# EAGLE design HLD-stat-tracker-bottom (EAGLE 9.6.1)
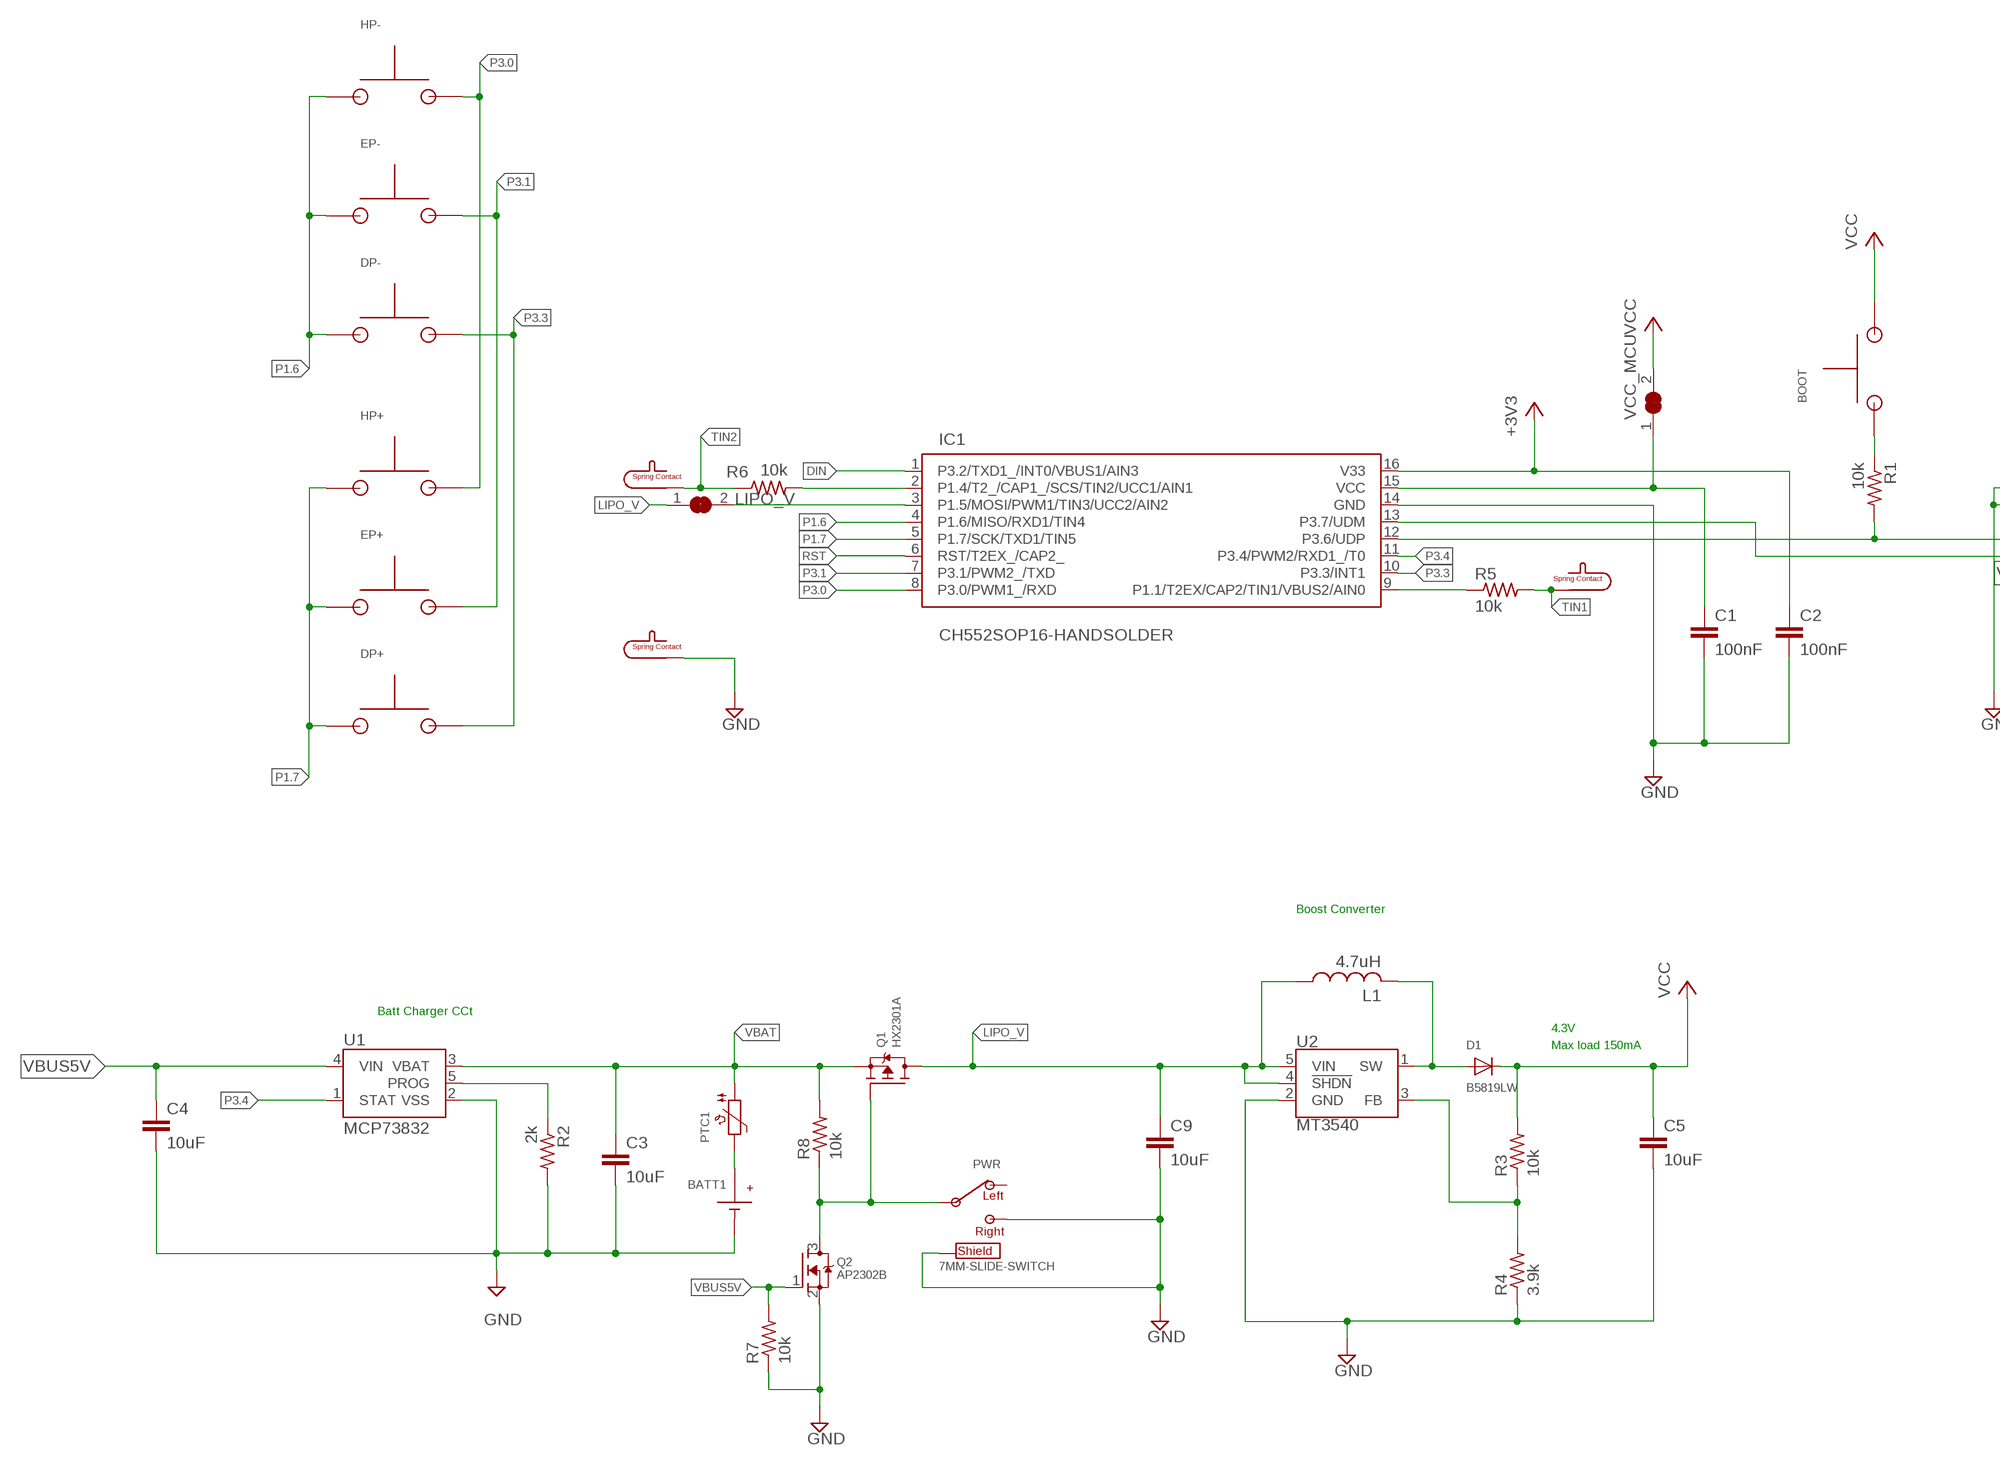
[diagram p0: schematic, sheet 1, part 1 of 2]
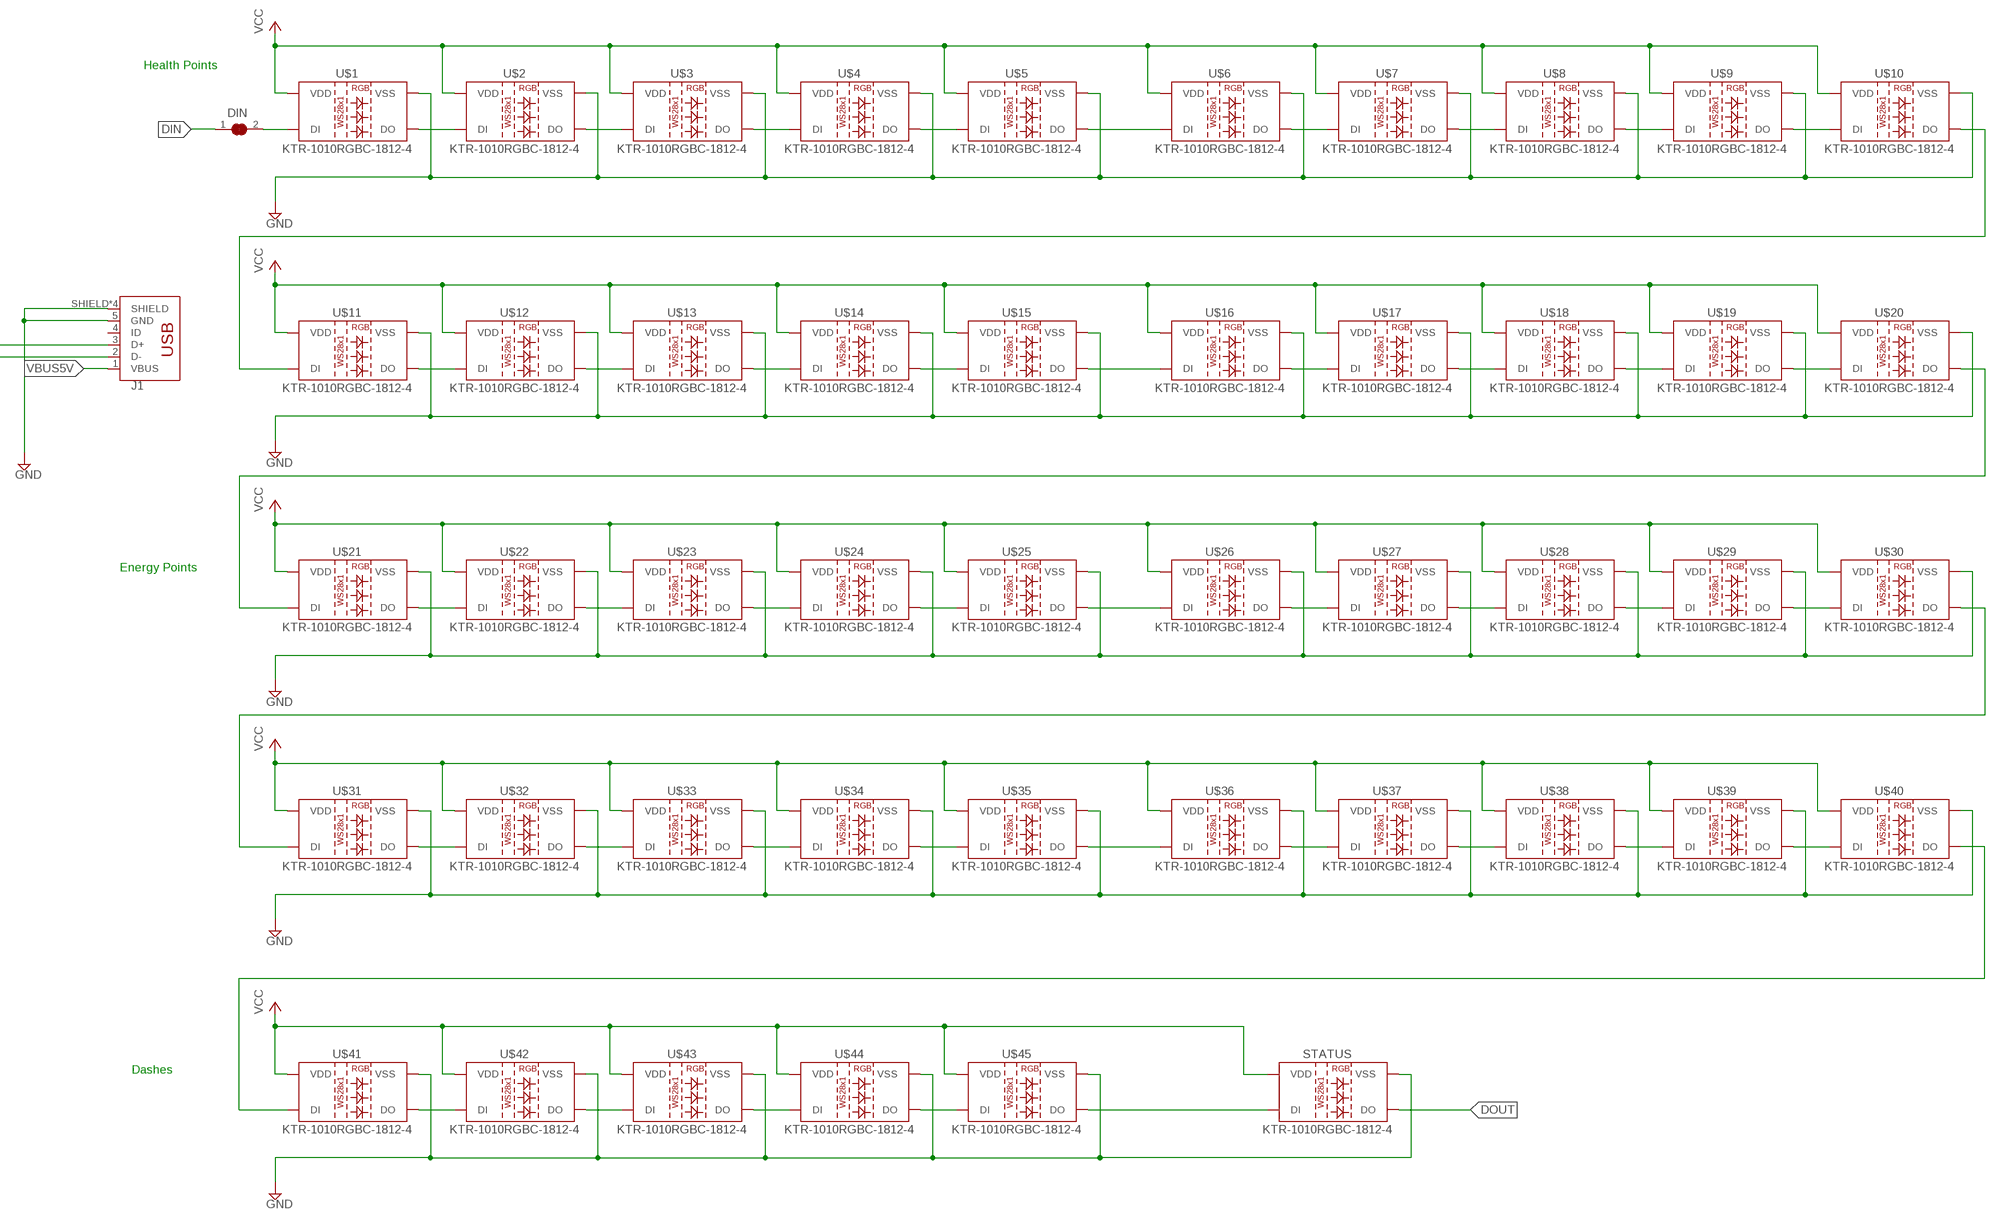
[diagram p1: schematic, sheet 1, part 2 of 2]

## Parts
BATT1  BATT+  [BATT+PAD]
BATT1-  BATT-  [BATT-PAD]
BOOT  TACTSW  [3MM-TACT]
C1  100nF  C-EUC0805K  [C0805K]
C2  100nF  C-EUC0805K  [C0805K]
C3  10uF  C-EUC0805K  [C0805K]
C4  10uF  C-EUC0805K  [C0805K]
C5  10uF  C-EUC0805K  [C0805K]
C9  10uF  C-EUC0805K  [C0805K]
D1  B5819LW  DIODESOD-123  [SOD-123]
DIN  SOLDERJUMPER-NC  [SOLDERJUMPER_CLOSEDWIRE_SMALL]
DP+  TACTSW  [3MM-TACT]
DP-  TACTSW  [3MM-TACT]
EP+  TACTSW  [3MM-TACT]
EP-  TACTSW  [3MM-TACT]
GND  SPRING-CONTACT  [818000905-SPRING-CONTACT]
HP+  TACTSW  [3MM-TACT]
HP-  TACTSW  [3MM-TACT]
IC1  CH552SOP16-HANDSOLDER  [SOP16-HANDSOLDER]
J1  USB_MICRO-BSINK-PLATE  [USB-B-MICRO-SMD-SINK-PLATE]
L1  4.7uH  INDUCTOR2012  [BEADC2012X105N]
LIPO_V  SOLDERJUMPER-NC  [SOLDERJUMPER_CLOSEDWIRE_SMALL]
PTC1  PTC0805  [WCAP-CSGP_0805_H1.25_R]
PWR  7MM-SLIDE-SWITCH  [7MM-SMD-SLIDE-SWITCH]
Q1  HX2301A  MOSFET-P  [SOT23-R]
Q2  AP2302B  MOSFET-NREFLOW  [SOT23-R]
R1  10k  R-US_R0805S  [R0805S]
R2  2k  R-US_R0805S  [R0805S]
R3  10k  R-US_R0805S  [R0805S]
R4  3.9k  R-US_R0805S  [R0805S]
R5  10k  R-US_R0805S  [R0805S]
R6  10k  R-US_R0805S  [R0805S]
R7  10k  R-US_R0805S  [R0805S]
R8  10k  R-US_R0805S  [R0805S]
STATUS  KTR-1010RGBC-1812-4  [SK6812-2020]
TIN1  SPRING-CONTACT  [818000905-SPRING-CONTACT]
TIN2  SPRING-CONTACT  [818000905-SPRING-CONTACT]
U1  MCP73832  MCP73831  [SOT23-5]
U2  MT3540  AP3012  [SOT23-5]
U$1  KTR-1010RGBC-1812-4  [SK6812-2020]
U$2  KTR-1010RGBC-1812-4  [SK6812-2020]
U$3  KTR-1010RGBC-1812-4  [SK6812-2020]
U$4  KTR-1010RGBC-1812-4  [SK6812-2020]
U$5  KTR-1010RGBC-1812-4  [SK6812-2020]
U$6  KTR-1010RGBC-1812-4  [SK6812-2020]
U$7  KTR-1010RGBC-1812-4  [SK6812-2020]
U$8  KTR-1010RGBC-1812-4  [SK6812-2020]
U$9  KTR-1010RGBC-1812-4  [SK6812-2020]
U$10  KTR-1010RGBC-1812-4  [SK6812-2020]
U$11  KTR-1010RGBC-1812-4  [SK6812-2020]
U$12  KTR-1010RGBC-1812-4  [SK6812-2020]
U$13  KTR-1010RGBC-1812-4  [SK6812-2020]
U$14  KTR-1010RGBC-1812-4  [SK6812-2020]
U$15  KTR-1010RGBC-1812-4  [SK6812-2020]
U$16  KTR-1010RGBC-1812-4  [SK6812-2020]
U$17  KTR-1010RGBC-1812-4  [SK6812-2020]
U$18  KTR-1010RGBC-1812-4  [SK6812-2020]
U$19  KTR-1010RGBC-1812-4  [SK6812-2020]
U$20  KTR-1010RGBC-1812-4  [SK6812-2020]
U$21  KTR-1010RGBC-1812-4  [SK6812-2020]
U$22  KTR-1010RGBC-1812-4  [SK6812-2020]
U$23  KTR-1010RGBC-1812-4  [SK6812-2020]
U$24  KTR-1010RGBC-1812-4  [SK6812-2020]
U$25  KTR-1010RGBC-1812-4  [SK6812-2020]
U$26  KTR-1010RGBC-1812-4  [SK6812-2020]
U$27  KTR-1010RGBC-1812-4  [SK6812-2020]
U$28  KTR-1010RGBC-1812-4  [SK6812-2020]
U$29  KTR-1010RGBC-1812-4  [SK6812-2020]
U$30  KTR-1010RGBC-1812-4  [SK6812-2020]
U$31  KTR-1010RGBC-1812-4  [SK6812-2020]
U$32  KTR-1010RGBC-1812-4  [SK6812-2020]
U$33  KTR-1010RGBC-1812-4  [SK6812-2020]
U$34  KTR-1010RGBC-1812-4  [SK6812-2020]
U$35  KTR-1010RGBC-1812-4  [SK6812-2020]
U$36  KTR-1010RGBC-1812-4  [SK6812-2020]
U$37  KTR-1010RGBC-1812-4  [SK6812-2020]
U$38  KTR-1010RGBC-1812-4  [SK6812-2020]
U$39  KTR-1010RGBC-1812-4  [SK6812-2020]
U$40  KTR-1010RGBC-1812-4  [SK6812-2020]
U$41  KTR-1010RGBC-1812-4  [SK6812-2020]
U$42  KTR-1010RGBC-1812-4  [SK6812-2020]
U$43  KTR-1010RGBC-1812-4  [SK6812-2020]
U$44  KTR-1010RGBC-1812-4  [SK6812-2020]
U$45  KTR-1010RGBC-1812-4  [SK6812-2020]
VCC_MCU  SOLDERJUMPER-NC  [SOLDERJUMPER_CLOSEDWIRE_SMALL]

## Nets
+3V3: C2.1 IC1.16(V33)
DIN: DIN.1 IC1.1(P3.2/TXD1_/INT0/VBUS1/AIN3)
DIN_: DIN.2 U$1.DIN(DI)
DOUT: STATUS.DOUT(DO)
FB: R3.1 R4.2 U2.3(FB)
GND: BATT1-.P$1(BATT-) C1.2 C2.2 C3.2 C4.2 C5.2 C9.2 GND.P$1 IC1.14(GND) J1.5(GND) J1.SHIELD J1.SHIELD2(SHIELD) J1.SHIELD3(SHIELD) J1.SHIELD4(SHIELD) PWR.3 PWR.GND@1(SHIELD) PWR.GND@2(SHIELD) PWR.GND@3(SHIELD) PWR.GND@4(SHIELD) Q2.2(S) R2.2 R4.1 R7.1 STATUS.VSS U1.2(VSS) U2.2(GND) U$1.VSS U$2.VSS U$3.VSS U$4.VSS U$5.VSS U$6.VSS U$7.VSS U$8.VSS U$9.VSS U$10.VSS U$11.VSS U$12.VSS U$13.VSS U$14.VSS U$15.VSS U$16.VSS U$17.VSS U$18.VSS U$19.VSS U$20.VSS U$21.VSS U$22.VSS U$23.VSS U$24.VSS U$25.VSS U$26.VSS U$27.VSS U$28.VSS U$29.VSS U$30.VSS U$31.VSS U$32.VSS U$33.VSS U$34.VSS U$35.VSS U$36.VSS U$37.VSS U$38.VSS U$39.VSS U$40.VSS U$41.VSS U$42.VSS U$43.VSS U$44.VSS U$45.VSS
LIPO_V: C9.1 L1.1 LIPO_V.1 Q1.3(D) U2.4(!SHDN!) U2.5(VIN)
LIPO_V_MCU: IC1.3(P1.5/MOSI/PWM1/TIN3/UCC2/AIN2) LIPO_V.2
N$1 [touch]: IC1.9(P1.1/T2EX/CAP2/TIN1/VBUS2/AIN0) R5.1
N$3: BATT1.P$1(BATT+) PTC1.2
N$4 [touch]: IC1.2(P1.4/T2_/CAP1_/SCS/TIN2/UCC1/AIN1) R6.2
N$5: PWR.2 Q1.1(G) Q2.3(D) R8.1
N$88: U$1.DOUT(DO) U$2.DIN(DI)
N$91: U$6.DOUT(DO) U$7.DIN(DI)
N$92: R2.1 U1.5(PROG)
N$93: U$20.DOUT(DO) U$21.DIN(DI)
N$94: U$11.DOUT(DO) U$12.DIN(DI)
N$95: U$16.DOUT(DO) U$17.DIN(DI)
N$96: U$12.DOUT(DO) U$13.DIN(DI)
N$97: U$13.DOUT(DO) U$14.DIN(DI)
N$98: U$14.DOUT(DO) U$15.DIN(DI)
N$103: U$15.DOUT(DO) U$16.DIN(DI)
N$104: U$2.DOUT(DO) U$3.DIN(DI)
N$105: U$3.DOUT(DO) U$4.DIN(DI)
N$106: U$4.DOUT(DO) U$5.DIN(DI)
N$107: U$5.DOUT(DO) U$6.DIN(DI)
N$108: U$7.DOUT(DO) U$8.DIN(DI)
N$109: U$8.DOUT(DO) U$9.DIN(DI)
N$110: U$9.DOUT(DO) U$10.DIN(DI)
N$111: U$17.DOUT(DO) U$18.DIN(DI)
N$112: U$18.DOUT(DO) U$19.DIN(DI)
N$113: U$19.DOUT(DO) U$20.DIN(DI)
N$114: U$10.DOUT(DO) U$11.DIN(DI)
N$115: U$21.DOUT(DO) U$22.DIN(DI)
N$116: U$26.DOUT(DO) U$27.DIN(DI)
N$117: U$22.DOUT(DO) U$23.DIN(DI)
N$118: U$23.DOUT(DO) U$24.DIN(DI)
N$119: U$24.DOUT(DO) U$25.DIN(DI)
N$120: U$25.DOUT(DO) U$26.DIN(DI)
N$121: U$27.DOUT(DO) U$28.DIN(DI)
N$122: U$28.DOUT(DO) U$29.DIN(DI)
N$123: U$29.DOUT(DO) U$30.DIN(DI)
N$124: U$31.DOUT(DO) U$32.DIN(DI)
N$125: U$36.DOUT(DO) U$37.DIN(DI)
N$126: U$32.DOUT(DO) U$33.DIN(DI)
N$127: U$33.DOUT(DO) U$34.DIN(DI)
N$128: U$34.DOUT(DO) U$35.DIN(DI)
N$129: U$35.DOUT(DO) U$36.DIN(DI)
N$130: U$37.DOUT(DO) U$38.DIN(DI)
N$131: U$38.DOUT(DO) U$39.DIN(DI)
N$132: U$39.DOUT(DO) U$40.DIN(DI)
N$133: U$30.DOUT(DO) U$31.DIN(DI)
N$134: U$41.DOUT(DO) U$42.DIN(DI)
N$135: U$42.DOUT(DO) U$43.DIN(DI)
N$136: U$43.DOUT(DO) U$44.DIN(DI)
N$137: U$44.DOUT(DO) U$45.DIN(DI)
N$138: STATUS.DIN(DI) U$45.DOUT(DO)
N$139: U$40.DOUT(DO) U$41.DIN(DI)
N$142: BOOT.1 BOOT.2 R1.1
P1.6: DP-.1 DP-.2 EP-.1 EP-.2 HP-.1 HP-.2 IC1.4(P1.6/MISO/RXD1/TIN4)
P1.7: DP+.1 DP+.2 EP+.1 EP+.2 HP+.1 HP+.2 IC1.5(P1.7/SCK/TXD1/TIN5)
P3.0: HP+.3 HP+.4 HP-.3 HP-.4 IC1.8(P3.0/PWM1_/RXD)
P3.1: EP+.3 EP+.4 EP-.3 EP-.4 IC1.7(P3.1/PWM2_/TXD)
P3.3: DP+.3 DP+.4 DP-.3 DP-.4 IC1.10(P3.3/INT1)
P3.4: IC1.11(P3.4/PWM2/RXD1_/T0) U1.1(STAT)
RST: IC1.6(RST/T2EX_/CAP2_)
SW: D1.A L1.2 U2.1(SW)
TIN1 [touch]: R5.2 TIN1.P$1
TIN2 [touch]: R6.1 TIN2.P$1
UDM: IC1.13(P3.7/UDM) J1.2(D-)
UDP: IC1.12(P3.6/UDP) J1.3(D+) R1.2
VBAT: C3.1 PTC1.1 Q1.2(S) R8.2 U1.3(VBAT)
VBUS5V: C4.1 J1.1(VBUS) Q2.1(G) R7.2 U1.4(VIN)
VCC: BOOT.3 BOOT.4 C5.1 D1.C R3.2 STATUS.VDD U$1.VDD U$2.VDD U$3.VDD U$4.VDD U$5.VDD U$6.VDD U$7.VDD U$8.VDD U$9.VDD U$10.VDD U$11.VDD U$12.VDD U$13.VDD U$14.VDD U$15.VDD U$16.VDD U$17.VDD U$18.VDD U$19.VDD U$20.VDD U$21.VDD U$22.VDD U$23.VDD U$24.VDD U$25.VDD U$26.VDD U$27.VDD U$28.VDD U$29.VDD U$30.VDD U$31.VDD U$32.VDD U$33.VDD U$34.VDD U$35.VDD U$36.VDD U$37.VDD U$38.VDD U$39.VDD U$40.VDD U$41.VDD U$42.VDD U$43.VDD U$44.VDD U$45.VDD VCC_MCU.2
VCC_MCU: C1.1 IC1.15(VCC) VCC_MCU.1
Unconnected: J1.4(ID) PWR.1

## Notes on the sheet
- Health Points
- Energy Points
- Boost Converter
- Batt Charger CCt
- 4.3V
- Max load 150mA
- Dashes

## Library data of the parts
BATT1 = Albert:BATT+; PARTNO: ?
BATT1- = Albert:BATT-; PARTNO: ?
BOOT DP+ DP- EP+ EP- HP+ HP- = Albert:TACTSW; MANUFACTURER: SHOU HAN; PARTNO: TS3315A
C1-C5 C9 = rcl:C-EU: CAPACITOR, European symbol; PARTNO: ?; SPICEPREFIX: C
D1 = microbuilder:DIODE: Diode SMA Model Volts Amps Type Vf Vr Digikey # Notes SSA34-E3 40V 3A Schottky 480mV @ 3A 200uA @ 40V SSA34-E3/61TGITR-ND CDBA120-G 20V 1A Schottky 500mV @ 1A 500uA @ 20V 641-1014-6-ND REEL MBRA210 10V 2A Schottky 350mV @ 2A 700uA @ 10V MBRA210LT3 SOD-123 Model Volts Amps Type Vf Vr Order # Notes BAT54T1G 30V 200mA Schottky 800mV @ 200mA 2uA @ 25V BAT54T1GOSTR-ND B0530W 30V 500mA Schottky 430mV @ 500mA 130uA @ 30V B0530W-FDICT-ND REEL MBR120 1A 20V Schottky 340mV @ 1A MBR120VLSFT1GOSCT-ND SOD-323 Model Volts Amps Type Vf Vr Order # Notes PMEG2005EJ 20V 500mA Schottky 355mV @ 500mA 568-4110-1-ND ZLLS410 10V 570mA Schottky 380mV @ 570mA ZLLS410CT-ND 1N4148WS 75V 150mA Silicon/Simple 1V 1N4148WSFSCT-ND REEL SOD-523 Model Volts Amps Type Vf Vr Order # Notes BAT54XV2 30V 200mA Schottky 0.8V @ 100mA BAT54XV2CT-ND TB751S 30V 30mA Schottky RB751S-40TE61CT-ND SOT23-R/W (R = Solder Paste/Reflow Ovens, W = Hand-Soldering) Model Volts Amps Type Vf Vr Order # Notes BAT54FILM 40V 300mA Schottky 497-7162-1-ND; MANUFACTURER: Guangdong Hottech; PARTNO: B5819LW
DIN LIPO_V VCC_MCU = Albert:SOLDERJUMPER-NC: A very small jumper used for isolating circuits for trouble shooting when there is a problem. Contains no stop mask and thus requires scrapping of the solder mask to use.
GND TIN1 TIN2 = Albert:SPRING-CONTACT; MANUFACTURER: ECT; PARTNO: ECT818000905
IC1 = Albert:CH552: Microcontroller; MANUFACTURER: WCH(Jiangsu Qin Heng); PARTNO: CH552G
J1 = Albert:USB_MICRO-B: USB Type Micro-B Connector Male/female and PTH/SMT variants SparkFun Products: SparkFun microB USB Breakout <https://www.sparkfun.com/products/12035> SparkFun USB microB Plug Breakout <https://www.sparkfun.com/products/10031> SparkFun ESP8266 Thing <https://www.sparkfun.com/products/13231> SINK-PLATE https://lcsc.com/product-detail/USB-Connectors_Jing-Extension-of-the-Electronic-Co-Jing-Extension-of-the-Electronic-Co-micro-5PBroken-plate1-274-Pins-High-temperature_C40957.html; MANUFACTURER: Jing Extension of the Electronic Co.; PARTNO: C40957
L1 = Albert:INDUCTOR: NRS6014 Inductor https://www.yuden.co.jp/productdata/catalog/wound04_e.pdf; MANUFACTURER: INPAQ; PARTNO: C315723
PTC1 = Albert:PTC: PTC (Resettable Fuse) 1206 Package 250mA PTC (16V Max, Time-to-Trip: 0.08s) - Digikey: F2110CT-ND 1210 Package 100mA PTC (30V Max, Time-to-Trip: 0.6s) - Digikey: MF-USMF010-2CT-ND 1812 Package 750mA PTC (24V Max, Time-to-Trip: 0.2s) - Digikey: MF-MSMF075/24-2CT-ND 0805; MANUFACTURER: Jinrui Electronic Materials Co.; PARTNO: JK-SMD0805-075
PWR = Albert:7MM-SLIDE-SWITCH: PN: SSSS811101 7mm SMD SLIDE SWITCH From aliexpress: https://www.aliexpress.com/item/32997544652.html?spm=a2g0o.productlist.0.0.7bb2e91euJEiso&algo_pvid=a8dd7320-e9ba-4f65-9763-0b5ae920e4a3&algo_expid=a8dd7320-e9ba-4f65-9763-0b5ae920e4a3-5&btsid=6eac8b71-d4cf-4052-8482-e303b818d048&ws_ab_test=searchweb0_0,searchweb201602_7,searchweb201603_53; MANUFACTURER: XKB Enterprise; PARTNO: SK-3296S-01-L1
Q1 = microbuilder:MOSFET-P: P-Channel Mosfet LEGEND VDS: Voltage Drain-Source ID: Drain Current RDS(ON): Drain-Source On-State Resistance VGS(TH): Gate-Source Threshold Voltage CISS: Drain-Source Input Capacitance SOT-23 Name VDS ID RDS(ON) VGS(TH) CISS Order Number IRLML5103 30V 760mA 600 mOhm -- 75pF @ 25V Digikey: IRLML5103PBFCT-ND IRLML6401 12V 4.3A 50 mOhm 950mV @ 250µA 830pF @ 10V Digikey: IRLML6401PBFTR-ND NTR0202PL 20V 400mA 800 mOhm 2.3V @ 250uA 70pF @ 5V Digikey: NTR0202PLT1GOSTR-ND NTR4101PT1G 20V 1.8A 85 mOhm 1.2V @ 250uA 675pF @ 10V Digikey: NTR4101PT1GOSCT-ND DMP2004K 20V 600mA 900 mOhm 1V @ 250uA 175pF @ 16V Digikey: DMP2004KDICT-ND PMV65XP 20V 3.9A 76 mOhm 950mV @ 1mA 725pF @ 20V Digikey: 568-2358-2-ND TO-252 Name VDS ID RDS(ON) VGS(TH) CISS Order Number AOD417 30V 25A 34 mOhm 3V @ 250µA 920pF @ 15V Digikey: 785-1106-2-ND; MANUFACTURER: HX(hengjiaxing); PARTNO: HX2301A
Q2 = microbuilder:MOSFET-N: N-Channel Mosfet LEGEND VDS: Voltage Drain-Source ID: Drain Current RDS(ON): Drain-Source On-State Resistance VGS(TH): Gate-Source Threshold Voltage CISS: Drain-Source Input Capacitance SOT-23 Name VDS ID RDS(ON) VGS(TH) CISS Order Number 2N7002E 60V 260mA 2.5 Ohm 2.5V @ 250uA 26.7pF @ 25V 2N7002ET1GOSTR-ND BSH103 30V 850mA 400 mOhm 400mV @ 1mA 83pF @ 24V BSH103,235-ND BSS138 60V 320mA 1.6 Ohm 1.5V @ 250uA 50pF @ 10V Mouser: 771-BSS138PW115 DMN2075U-7 20V 4.2A 38 mOhm 1V @ 250 uA 594.3pF @ 10V DMN2075U-7DICT-ND * BSS138 good choice for I2C level-shifting; MANUFACTURER: HX(hengjiaxing); PARTNO: AP2302B
R1-R8 = resistor:R-US_: RESISTOR, American symbol; PARTNO: ?
STATUS U$1-U$45 = Albert:KTR-1010RGBC-1812-4: Addressable RGD LED similiar to SK6812-2020. http://pegasusprototyping.ca/assets/downloads/1010%E5%B9%BB%E5%BD%A9%E5%9B%9B%E8%84%9A%E8%A7%84%E6%A0%BC%E4%B9%A6T.pdf This pinout is same as SK6812 Mini where as the DIN is in the bottom right with the notch. Although this package doesnt have a notch exactly.; MANUFACTURER: KTRLIGHT; PARTNO: KTR-1010RGBC-1812-4
U1 = SparkFun-PowerIC:MCP73831: Miniature single cell, fully integrated Li-Ion, Li-polymer charge management controller http://ww1.microchip.com/downloads/en/DeviceDoc/20001984g.pdf IC-09995; MANUFACTURER: Microchip Tech; PARTNO: MCP73832; PROD_ID: IC-09995
U2 = SparkFun-IC-Power:AP3012: AP3012 The AP3012 is a high power, constant frequency, current mode PWM, inductor based, step-up (boost) converter. The converter operates at high frequency (1.5MHz) so that a small, low profile inductor can be used. Datasheet <https://www.diodes.com/assets/Datasheets/AP3012.pdf>; MANUFACTURER: XI'AN Aerosemi Tech; PARTNO: MT3540; PROD_ID: VREG-13911; VALUE: AP3012

## Net classes
1 touch: width 0.2 mm, clearance 0.2 mm

## Board
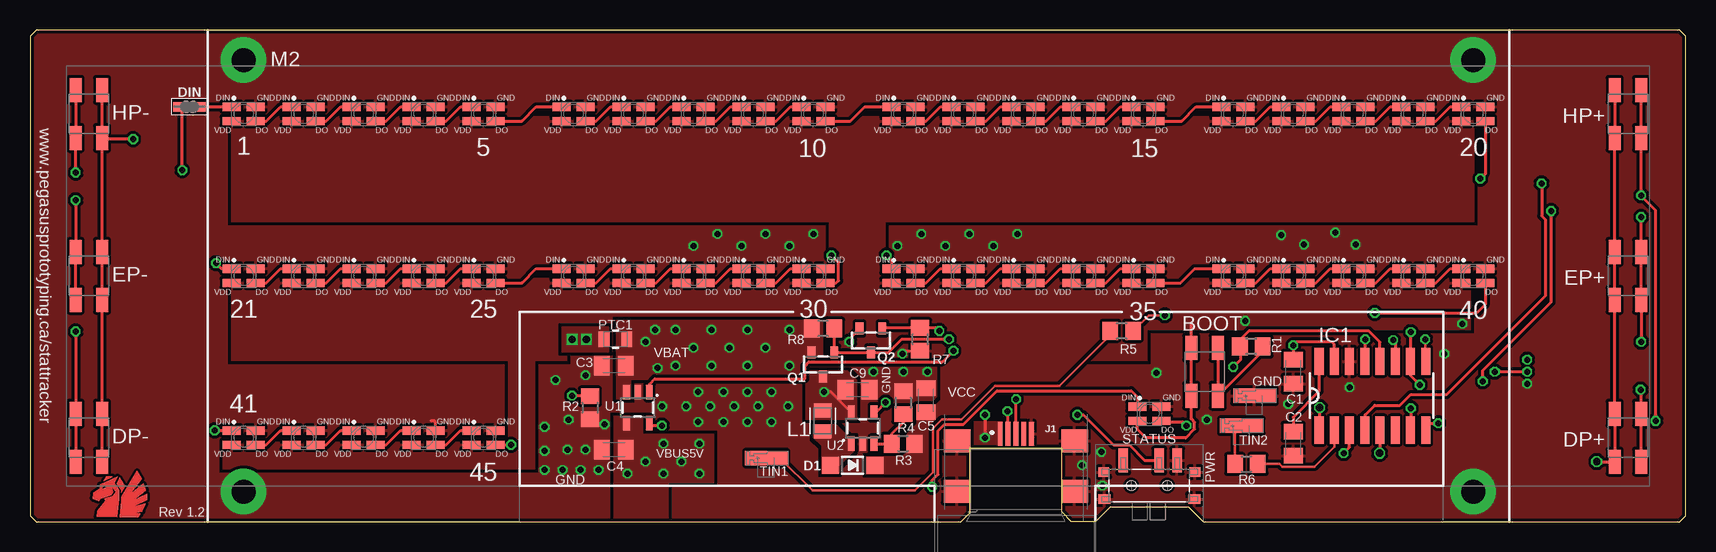
[diagram p2: board, top side]
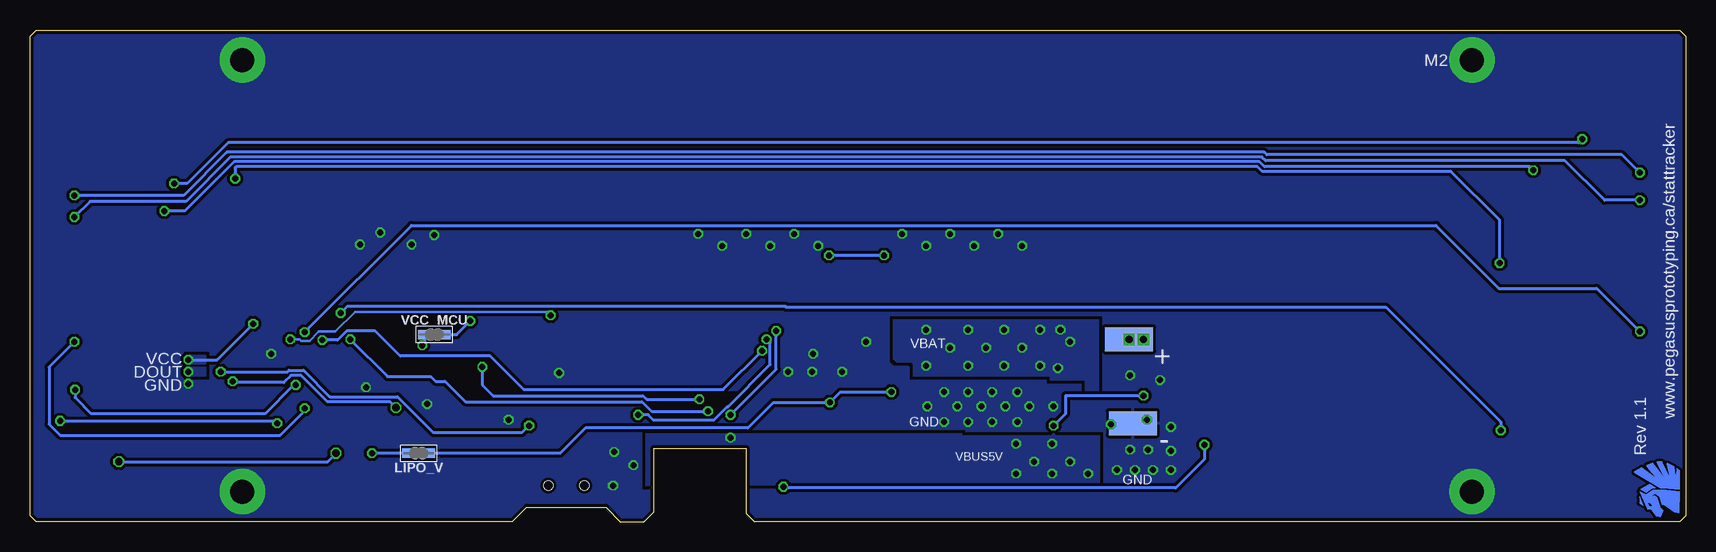
[diagram p3: board, bottom side, seen from below]

Size 138 x 41 mm. Coordinates in mm from the lower left corner, seen from the top.
Outline: 97.8,0 137.5,0 138,0.5 138,40.5 137.5,41 0.5,41 0,40.5 0,0.5 0.5,0 77.6,0 78.3,0.7 78.3,6.1 86,6.1 86,0.8 86.8,0 88.8,0 90,1.2 96.6,1.2 97.8,0
Copper layers (1*16): Top 0.035mm / dielectric 1.5mm / Bottom 0.035mm
Design rules "Makerfabs Eagle Rule 2016-06-12 *": minimum track width 6mil, minimum drill 0.3mm, track to track 6mil, track to pad 6mil, pad to pad 6mil, via to via 6mil, smd to smd 0mil, copper to edge 0.2mm, drill to drill 10mil, minimum pad ring 10mil, minimum via ring 6mil, stop-mask expansion 2mil, vias tented up to drill 25mil, thermal gap 10mil

### Footprints (pad centres in the part's own frame; a part is rotated, then mirrored left to right if it is on the bottom)
BATT+PAD = smd 4 x 2: P$1 0,0
BATT-PAD = smd 4 x 2: P$1 0,0
3MM-TACT = smd 2 x 1: 1 -2,1.2; 2 2,1.2; 3 -2,-1; 4 2,-1
C0805K = smd 1.3 x 1.6: 1 -1,0; 2 1,0
SOD-123 = smd 1.4 x 1.4: A 1.85,0; C -1.85,0
SOLDERJUMPER_CLOSEDWIRE_SMALL = smd 1.2 x 0.8: 1 -0.762,0; 2 0.762,0 | smd 0.635 x 0.25: WIRE 0,0
818000905-SPRING-CONTACT = smd 1.2 x 3.53: P$1 -0.01,0.63
SOP16-HANDSOLDER = smd 2.27 x 0.76: 1 -2.865,4.445; 2 -2.865,3.175; 3 -2.865,1.905; 4 -2.865,0.635; 5 -2.865,-0.635; 6 -2.865,-1.905; 7 -2.865,-3.175; 8 -2.865,-4.445; 9 2.865,-4.445; 10 2.865,-3.175; 11 2.865,-1.905; 12 2.865,-0.635; 13 2.865,0.635; 14 2.865,1.905; 15 2.865,3.175; 16 2.865,4.445
USB-B-MICRO-SMD-SINK-PLATE = smd 0.4 x 2: 1 -1.3,3.76; 2 -0.65,3.76; 3 0,3.76; 4 0.65,3.76; 5 1.3,3.76 | smd 2.2 x 1.9: SHIELD 4.9,3.16; SHIELD2 4.9,-1.04; SHIELD3 -4.9,-1.04; SHIELD4 -4.9,3.16
BEADC2012X105N = smd 1.165 x 1.465: 1 -0.875,0; 2 0.875,0
WCAP-CSGP_0805_H1.25_R = smd 0.9 x 1.3: 1 -0.95,0; 2 0.95,0
7MM-SMD-SLIDE-SWITCH = smd 0.8 x 2: 1 -2.177,2.1; 2 0.823,2.1; 3 2.323,2.1 | smd 1 x 0.8: GND@1 -3.75,-1.125; GND@4 3.75,-1.125 | smd 0.9 x 0.8: GND@2 -3.8,1.125; GND@3 3.8,1.125 | hole 0.8: -1.5,0; 1.5,0
SOT23-R = smd 0.635 x 1.016: 1 -0.95,-1; 2 0.95,-1; 3 0,1
R0805S = smd 1.3 x 1.5: 1 -0.95,0; 2 0.95,0
SK6812-2020 = smd 1.5 x 0.7: DIN 1,-0.6; DOUT -1,0.6; VDD 1,0.6; VSS -1,-0.6
SOT23-5 = smd 0.55 x 1.2: 1 -0.95,-1.3; 2 0,-1.3; 3 0.95,-1.3; 4 0.95,1.3; 5 -0.95,1.3

### Placement (x,y rotation side)
BATT1  46.38,15.2 180 bottom
BATT1-  46.08,8.2 180 bottom
BOOT  97.8,12.5 270 top
C1  105.3,12.5 270 top
C2  105.3,6.5 270 top
C3  48.68,13 180 top
C4  48.68,6 180 top
C5  74.68,10.12 90 top
C9  68.98,11 0 top
D1  68.58,4.7 180 top
DIN  13.3,34.6 0 top
DP+  133.3,7 90 top
DP-  4.8,7 270 top
EP+  133.3,20.5 90 top
EP-  4.8,20.5 270 top
GND  102.7,10.5 90 top
HP+  133.3,34 90 top
HP-  4.8,34 270 top
IC1  111.9,10.5 90 top
J1  82.18,3.56 0 top
L1  66.08,8.4 270 top
LIPO_V  105.6,5.7 180 bottom
PTC1  48.8,15.2 180 top
PWR  93.3,3 0 top
Q1  66.1,13.1 180 top
Q2  70.1,15.1 180 top
R1  101.8,14.6 180 top
R2  46.68,9.5 270 top
R3  72.78,6.5 0 top
R4  72.8,9.93 270 top
R5  91,15.9 180 top
R6  101.4,4.8 0 top
R7  74.2,15.2 90 top
R8  66.1,16.1 180 top
STATUS  93.3,9 180 top
TIN1  62,5.3 90 top
TIN2  101.6,8 90 top
U1  50.68,9.5 180 top
U2  69.4,7.8 0 top
U$1  17.8,34 180 top
U$2  22.8,34 180 top
U$3  27.8,34 180 top
U$4  32.8,34 180 top
U$5  37.8,34 180 top
U$6  45.3,34 180 top
U$7  50.3,34 180 top
U$8  55.3,34 180 top
U$9  60.3,34 180 top
U$10  65.3,34 180 top
U$11  72.8,34 180 top
U$12  77.8,34 180 top
U$13  82.8,34 180 top
U$14  87.8,34 180 top
U$15  92.8,34 180 top
U$16  100.3,34 180 top
U$17  105.3,34 180 top
U$18  110.3,34 180 top
U$19  115.3,34 180 top
U$20  120.3,34 180 top
U$21  17.8,20.5 180 top
U$22  22.8,20.5 180 top
U$23  27.8,20.5 180 top
U$24  32.8,20.5 180 top
U$25  37.8,20.5 180 top
U$26  45.3,20.5 180 top
U$27  50.3,20.5 180 top
U$28  55.3,20.5 180 top
U$29  60.3,20.5 180 top
U$30  65.3,20.5 180 top
U$31  72.8,20.5 180 top
U$32  77.8,20.5 180 top
U$33  82.8,20.5 180 top
U$34  87.8,20.5 180 top
U$35  92.8,20.5 180 top
U$36  100.3,20.5 180 top
U$37  105.3,20.5 180 top
U$38  110.3,20.5 180 top
U$39  115.3,20.5 180 top
U$40  120.3,20.5 180 top
U$41  17.8,7 180 top
U$42  22.8,7 180 top
U$43  27.8,7 180 top
U$44  32.8,7 180 top
U$45  37.8,7 180 top
U$52  [PEGASUSPROTOTYPING_5MM_COPPER]  5.2,0.4 0 top
U$53  [PEGASUSPROTOTYPING_5MM_COPPER]  0.5,0.4 90 bottom
VCC_MCU  104.3,15.6 0 bottom

### Tracks (layer width: path | path; a pad name or v marks a point on that pad's centre or on a via)
+3V3
  Top 0.25: IC1.16 107.45,10.86 105.3,8.7 C2.1
DIN  (via drill 0.5, 0.6)
  Top 0.25: v107.5,9.5 107.5,7.7 IC1.1 | v121.1,11.7 121.1,12.6 126.8,18.3 v126.8,25.9 | DIN.1 12.7,34.44 v12.7,29.3
  Bottom 0.25: v107.5,9.5 108,10 113.2,10 115.41,12.2 116.24,12.2 116.85,11.6 121,11.6 v121.1,11.7 | v12.7,29.3 13,29.6 35.1,29.6 35.5,30.01 120.99,30.01 125.1,25.9 v126.8,25.9
DIN_
  Top 0.25: DIN.2 U$1.DIN
DOUT  (via drill 0.5)
  Top 0.25: v124.8,12.5 v122.1,12.5 | STATUS.DOUT 94.94,8.4 95.02,8.32 96.08,8.32 v96.4,8
  Bottom 0.25: v122.1,12.5 116.52,12.5 116.41,12.61 115.21,12.61 113,10.4 107.37,10.4 104.39,7.42 96.98,7.42 v96.4,8
  pour Bottom: 124.8,12.8 123.4,12.8 123.4,12.3 123.4,12.2 124.8,12.2
FB
  Top 0.25: R4.2 72.8,8.27 71.83,7.3 R3.1 | R3.1 | U2.3 R3.1
GND  (via drill 0.5, 2 pad 3.8)
  Top 0.25: v68.3,15 68.3,15.25 Q2.2 | U$44.VSS 33.8,8.3 33.7,8.4 33.4,8.4 | v72.71,13.99 72.97,14.25 R7.1
  other vias: 46.3,6 47.4,4.3 45.9,4.3 44.4,4.3 44.8,6 47.9,8.1 42.9,4.3 42.9,5.9 42.9,7.9 44.9,8.5 110,11.2 108.8,24.1 110.5,23.1 93.9,12.4 117.9,14 104.3,23.9 74.8,12.5 72.8,12.5 70.3,12.5 52.7,9.6 54.7,9.6 56.7,9.6 55.7,10.8 55.7,8.3 57.8,8.3 57.8,10.8 59.8,10.8 61.8,10.8 59.8,8.3 61.8,8.3 58.7,9.6 60.7,9.6 63.2,9.6 106.2,23.1 46.3,12.2 43.8,11.8 17.8,38.5 120.3,38.5 120.3,2.5 17.8,2.5 124.8,11.5 55.3,23 57.3,24 59.3,23 61.3,24 63.3,23 65.3,24 72.3,23 74.3,24 76.3,23 78.3,24 80.3,23 82.3,24 89.3,5.8 87.7,4.7 89.4,3 104.9,9.8 98.1,8.5
  pour Top (isolate 0.25, rank 3, no thermals): 59.98,12 53.18,12 53.18,11.5 52.18,11.5 52.18,10 51.18,10 51.18,11.5 50.38,11.5 50.38,10 48.58,10 48.58,13.8 45.08,13.8 45.08,11.3 47.58,11.3 47.58,9.4 44.58,9.4 44.58,0.2 48.48,0.2 48.48,9 51.78,9 52.28,8.5 59.98,8.5
  pour Bottom (isolate 0.25, rank 3): 59.98,12 53.18,12 53.18,11.5 50.38,11.5 50.38,10 48.58,10 48.58,13.8 45.08,13.8 45.08,9.4 44.58,9.4 44.58,0.2 48.48,0.2 48.48,7.5 59.98,7.5
  pour Bottom (isolate 0.25, rank 4, no thermals): 67.73,10.9 95.74,10.9 95.74,16 80.8,16 80.8,24.8 36.75,24.7 36.75,10.5 48.68,10.5 48.68,17.5 67.73,17.5
  pour Bottom: 56.9,2.8 56.9,0.1 88.1,0.2 88.1,2.8
  pour Bottom (isolate 0.25, rank 6): 0,41 0,0 138,0 138,41
  pour Top (isolate 0.25, rank 5, no thermals): 69.1,5.8 69.1,12.3 75.8,12.3 75.8,10.2 75.3,9.7 73.3,9.7 73.3,5.8 69.8,5.8 69.5,5.5 69.5,4.9 69.3,4.7 68.1,4.7 68.1,4.8
  pour Top (isolate 0.25, rank 6): 137.7,41 137.7,0 0,0 0,41
LIPO_V  (via drill 0.5)
  Top 0.25: U2.5 66.75,10.8 v66.2,10.8 | v71.33,9.93 70.5,9.1 U2.4
  Bottom 0.25: v66.2,10.8 70.45,10.8 v71.33,9.93 76.03,9.93 78.15,7.8 91.7,7.8 93.8,5.7 LIPO_V.1
  pour Top (isolate 0.25, no thermals): 64.8,12.6 68.1,12.6 68.9,11.8 68.9,8.5 64.7,8.5 64.7,12.6
LIPO_V_MCU  (via drill 0.5)
  Top 0.25: v109.5,5.7 109.99,6.2 IC1.3
  Bottom 0.25: LIPO_V.2 v109.5,5.7
N$1  (via drill 0.5)
  Top 0.2: R5.1 93.25,17.2 v94.6,17.2 | v116.3,15.2 116.3,13.41 IC1.9
  Bottom 0.2: v116.3,15.2 115.53,15.2 115.4,15.07 114.69,15.07 113.93,15.84 112.56,15.84 110.9,17.5 94.9,17.5 v94.6,17.2
N$3  (via drill 0.6)
  other vias: 46.38,15.2 45.18,15.2
  pour Top (no thermals): 44.4,16.2 44.4,14.2 48.2,14.2 48.2,16.2
N$4
  Top 0.2: IC1.2 108.72,6.23 107.05,4.55 104.38,4.55 104.13,4.8 R6.2
N$5  (via drill 0.5)
  Top 0.25: R8.1 Q1.1 Q2.3 71.56,14.1 72.64,15.18 76.58,15.18 v76.6,15.2 | v87.3,8.9 87.8,8.9 90.32,6.38 91.64,6.38 92.91,5.1 PWR.2
  Bottom 0.25: v87.3,8.9 86.47,8.9 86.06,8.5 80.97,8.5 79.88,9.58 79.82,9.58 76.3,13.1 76.3,14.9 v76.6,15.2
N$88
  Top 0.25: U$1.DOUT 19.7,33.4 20.9,34.6 U$2.DIN
N$91
  Top 0.25: U$6.DOUT 47.2,33.4 48.4,34.6 U$7.DIN
N$92  (via drill 0.5)
  Top 0.25: U1.5 51.68,8 v52.68,8 | v45.18,10.5 46.68,10.5 R2.1
  Bottom 0.25: v52.68,8 51.68,9 51.68,10.5 v45.18,10.5
N$93  (via drill 0.5)
  Top 0.25: U$20.DOUT 121.3,29 v120.9,28.6 | U$21.DIN 15.95,21.1 v15.5,21.55
  Bottom 0.25: v15.5,21.55 15.5,25.15 19.55,29.2 35.27,29.2 35.67,29.6 120.8,29.6 120.9,29.5 v120.9,28.6
N$94
  Top 0.25: U$11.DOUT 74.7,33.4 75.9,34.6 U$12.DIN
N$95
  Top 0.25: U$16.DOUT 102.2,33.4 103.4,34.6 U$17.DIN
N$96
  Top 0.25: U$12.DOUT 79.7,33.4 80.9,34.6 U$13.DIN
N$97
  Top 0.25: U$13.DOUT 84.7,33.4 85.9,34.6 U$14.DIN
N$98
  Top 0.25: U$14.DOUT 89.7,33.4 90.9,34.6 U$15.DIN
N$103
  Top 0.25: U$15.DOUT 96,33.4 97.2,34.6 U$16.DIN
N$104
  Top 0.25: U$2.DOUT 24.7,33.4 25.9,34.6 U$3.DIN
N$105
  Top 0.25: U$3.DOUT 29.7,33.4 30.9,34.6 U$4.DIN
N$106
  Top 0.25: U$4.DOUT 34.7,33.4 35.9,34.6 U$5.DIN
N$107
  Top 0.25: U$5.DOUT 41,33.4 42.2,34.6 U$6.DIN
N$108
  Top 0.25: U$7.DOUT 52.2,33.4 53.4,34.6 U$8.DIN
N$109
  Top 0.25: U$8.DOUT 57.2,33.4 58.4,34.6 U$9.DIN
N$110
  Top 0.25: U$9.DOUT 62.2,33.4 63.4,34.6 U$10.DIN
N$111
  Top 0.25: U$17.DOUT 107.2,33.4 108.4,34.6 U$18.DIN
N$112
  Top 0.25: U$18.DOUT 112.2,33.4 113.4,34.6 U$19.DIN
N$113
  Top 0.25: U$19.DOUT 117.2,33.4 118.4,34.6 U$20.DIN
N$114
  Top 0.25: U$10.DOUT 68.4,33.4 69.6,34.6 U$11.DIN
N$115
  Top 0.25: U$21.DOUT 19.7,19.9 20.9,21.1 U$22.DIN
N$116
  Top 0.25: U$26.DOUT 47.2,19.9 48.4,21.1 U$27.DIN
N$117
  Top 0.25: U$22.DOUT 24.7,19.9 25.9,21.1 U$23.DIN
N$118
  Top 0.25: U$23.DOUT 29.7,19.9 30.9,21.1 U$24.DIN
N$119
  Top 0.25: U$24.DOUT 34.7,19.9 35.9,21.1 U$25.DIN
N$120
  Top 0.25: U$25.DOUT 41,19.9 42.2,21.1 U$26.DIN
N$121
  Top 0.25: U$27.DOUT 52.2,19.9 53.4,21.1 U$28.DIN
N$122
  Top 0.25: U$28.DOUT 57.2,19.9 58.4,21.1 U$29.DIN
N$123
  Top 0.25: U$29.DOUT 62.2,19.9 63.4,21.1 U$30.DIN
N$124
  Top 0.25: U$31.DOUT 74.7,19.9 75.9,21.1 U$32.DIN
N$125
  Top 0.25: U$36.DOUT 102.2,19.9 103.4,21.1 U$37.DIN
N$126
  Top 0.25: U$32.DOUT 79.7,19.9 80.9,21.1 U$33.DIN
N$127
  Top 0.25: U$33.DOUT 84.7,19.9 85.9,21.1 U$34.DIN
N$128
  Top 0.25: U$34.DOUT 89.7,19.9 90.9,21.1 U$35.DIN
N$129
  Top 0.25: U$35.DOUT 95.9,19.9 97.1,21.1 U$36.DIN
N$130
  Top 0.25: U$37.DOUT 107.2,19.9 108.4,21.1 U$38.DIN
N$131
  Top 0.25: U$38.DOUT 112.2,19.9 113.4,21.1 U$39.DIN
N$132
  Top 0.25: U$39.DOUT 117.2,19.9 118.4,21.1 U$40.DIN
N$133  (via drill 0.5)
  Top 0.25: U$30.DOUT 67.2,19.9 67.4,20.1 67.4,21.6 v66.8,22.2 | v71.4,22.2 71.8,21.8 U$31.DIN
  Bottom 0.25: v66.8,22.2 v71.4,22.2
N$134
  Top 0.25: U$41.DOUT 19.7,6.4 20.9,7.6 U$42.DIN
N$135
  Top 0.25: U$42.DOUT 24.7,6.4 25.9,7.6 U$43.DIN
N$136
  Top 0.25: U$43.DOUT 29.7,6.4 30.9,7.6 U$44.DIN
N$137
  Top 0.25: U$44.DOUT 34.7,6.4 35.9,7.6 U$45.DIN
N$138  (via drill 0.5)
  Top 0.25: v75.2,2.9 75.2,3.42 75.7,3.92 75.7,7.58 76.22,8.1 77.8,8.1 80.61,10.91 91.8,10.91 92.3,10.4 STATUS.DIN | U$45.DOUT v40.1,6.4
  Bottom 0.25: v40.1,6.4 40.1,5.2 42.5,2.8 75.1,2.8 v75.2,2.9
N$139  (via drill 0.5)
  Top 0.25: v112.1,17.4 120.6,17.4 121.3,18.1 U$40.DOUT | v15.4,7.6 U$41.DIN
  Bottom 0.25: v112.1,17.4 111.55,17.95 75.05,17.95 74.99,17.89 25,17.89 15.4,8.3 v15.4,7.6
N$142
  Top 0.25: BOOT.1 BOOT.2 102.75,14.25 R1.1
P1.6  (via drill 0.5)
  Top 0.25: HP-.1 HP-.2 6,31.9 | DP-.2 DP-.1 EP-.2 EP-.1 6,31.9 | v8.6,31.9 6,31.9 | v126,28.2 126,25.5 126.3,25.2 126.3,18.8 118.1,10.6 115.1,10.6 114.2,9.7 112.1,9.7 111.3,8.9 111.3,7.8 IC1.4
  Bottom 0.25: v126,28.2 124.9,28.2 121.5,31.6 8.9,31.6 v8.6,31.9
P1.7  (via drill 0.6)
  Top 0.25: HP+.2 HP+.1 EP+.2 EP+.1 DP+.2 DP+.1 v130.6,5 | v112.5,5.7 112.5,7.5 IC1.5
  Bottom 0.25: v112.5,5.7 113.2,5 v130.6,5
P3.0  (via drill 0.5)
  Top 0.25: HP+.4 HP+.3 v134.3,27.2 134.3,27.15 135.5,25.95 v135.5,8.4 | v117.4,8.2 116.35,8.2 116.35,7.65 IC1.8 | v3.8,29.1 HP-.4 HP-.3
  Bottom 0.25: v135.5,8.4 117.6,8.4 v117.4,8.2 | v3.8,29.1 5.3,30.6 34.9,30.6 35.11,30.81 121.59,30.81 125.2,27.2 v134.3,27.2
P3.1  (via drill 0.5)
  Top 0.25: v115.1,9.45 115.1,7.65 IC1.7 | v134.3,15 EP+.3 EP+.4 v134.3,25.4 | v3.8,26.8 EP-.3 EP-.4
  Bottom 0.25: v3.8,26.8 6.75,26.8 10.05,30.1 35,30.1 35.31,30.41 121.29,30.41 125,26.7 133,26.7 v134.3,25.4 | v134.3,15 136.41,12.89 136.41,8.11 135.49,7.2 117.16,7.2 115.1,9.25 v115.1,9.45
P3.3  (via drill 0.5)
  Top 0.25: DP+.3 DP+.4 134.3,10.95 v134.25,11 | v115.85,11.4 115.1,12.15 115.1,13.25 IC1.10 115.1,13.5 v115.1,15.8 | v3.8,15.85 DP-.3 DP-.4
  Bottom 0.25: v134.25,11 134.25,10.35 132.9,9 118.4,9 116.1,11.3 115.9,11.3 v115.85,11.4 | v3.8,15.85 7.4,19.45 15.55,19.45 20.8,24.7 106.19,24.7 v115.1,15.8
P3.4  (via drill 0.5)
  Top 0.25: U1.1 51.63,11.45 52.08,11.9 64.6,11.9 64.6,13 64.92,13.32 76.05,13.32 v76.98,14.24 | v113.63,15.14 113.8,14.97 IC1.11
  Bottom 0.25: v113.63,15.14 112.36,15.14 111.59,15.91 109.24,15.91 107.14,13.8 99.64,13.8 96.84,11 80.22,11 v76.98,14.24
SW
  pour Top (isolate 0.25, no thermals): 65.3,8.1 67.2,8.1 68.2,7.1 68.7,7.1 68.7,5.9 67.4,4.6 67.4,4.1 67.3,4 66,4 66,5.4 66,6.3 65.3,7
TIN1
  Top 0.2: TIN1.P$1 62.53,5.29 65.22,2.6 73.78,2.6 75.28,4.1 75.28,7.76 76.04,8.52 77.63,8.52 80.43,11.33 85.83,11.33 90.05,15.55 R5.2
TIN2
  Top 0.2: R6.1 100.45,7.47 TIN2.P$1
UDM  (via drill 0.5)
  Top 0.25: v111.3,15.2 111.3,13.4 IC1.13 | J1.2 81.53,9.13 81.6,9.2 v81.47,9.2
  Bottom 0.25: v81.47,9.2 86.2,9.2 87,10 101.7,10 103.4,11.7 104.2,11.7 104.6,12.1 108.2,12.1 v111.3,15.2
UDP  (via drill 0.5)
  Top 0.25: J1.3 82.18,10.18 v82.2,10.2 | v100.3,12.9 100.9,13.5 100.9,14.55 R1.2 100.85,15.15 101.61,15.91 111.59,15.91 112.53,14.96 IC1.12
  Bottom 0.25: v82.2,10.2 86.6,10.2 86.9,10.5 99.4,10.5 100.3,11.4 v100.3,12.9
VBAT  (via drill 0.5)
  other vias: 51.3,15 52.1,16 55.3,14.5 58.3,14.5 53.8,13 56.8,13 59.8,13 61.3,14.5 56.8,16 59.8,16 53.8,16 52.31,12.8 63.3,16 63.3,13
  pour Top (isolate 0.25, no thermals): 64.38,12.15 52.98,12.15 52.98,11.8 50.08,11.8 50.08,10.2 48.88,10.2 48.88,16.8 66.08,16.8 66.08,13.6 65.78,13.3 64.58,13.3 64.38,13.2
  pour Bottom (isolate 0.25, rank 2, no thermals): 64.38,12.15 52.98,12.15 52.98,11.8 50.08,11.8 50.08,10.2 48.88,10.2 48.88,16.8 66.08,16.8 66.08,13.6 65.78,13.3 64.58,13.3 64.38,13.2
VBUS5V  (via drill 0.5)
  Top 0.25: Q2.1 71.1,16.15 R7.2 75.55,16.15 v75.8,15.9 | v79.6,8.9 v79.6,7
  Bottom 0.25: v79.6,8.9 75.8,12.7 v75.8,15.9
  other vias: 49.8,4 51.3,5 52.8,4 52.8,6.5 54.3,5 55.8,6.5 55.8,4
  pour Top (isolate 0.25, rank 2, no thermals): 56.98,7.3 56.98,3.2 53.18,3.2 53.18,0.2 48.68,0.2 48.68,8.8 51.08,8.8 51.08,7.3
  pour Bottom (isolate 0.25, rank 5, no thermals): 56.98,3.2 53.18,3.2 53.18,0.2 48.68,0.2 48.68,7.3 86.7,7.3 86.7,3
  pour Top (no thermals): 81.03,6.4 81.03,8.3 78.7,8.3 78.7,6.4
VCC  (via drill 0.5)
  Top 0.25: 96.8,16.6 BOOT.3 BOOT.4 96.8,8.56 97.08,8.28 97.08,7.72 96.33,6.97 93.03,6.97 92.3,7.71 STATUS.VDD
  Bottom 0.25: VCC_MCU.2 102.42,15.6 v101.3,16.73 | v124.8,13.5 122.4,13.5 v119.4,16.5
  pour Top (isolate 0.25, no thermals): 69.7,5.4 69.7,4 76.1,4 76.1,6.9 80.8,11.6 85.6,11.6 91.1,17.1 75.9,17.1 75.9,10.1 75.4,9.6 73.9,9.6 73.9,8.1 73.1,7.3 73.1,5.8 72.7,5.4
  pour Top (isolate 0.25, rank 2): 16.8,33.8 120.35,33.8 120.35,25 16.8,25
  pour Top (isolate 0.25, rank 4): 16.8,20.3 120.05,20.3 120.05,16 93.1,16 93.1,13.4 16.8,13.4
  pour Top (isolate 0.25, rank 2): 39.9,4.35 39.9,13.85 42.05,13.85 42.05,4.35
  pour Top (isolate 0.25, rank 2): 16.1,6.65 42,6.65 42,4.35 16.1,4.35
  pour Top (isolate 0.25, rank 3): 66.65,19.6 66.65,25.75 71.25,25.75 71.25,19.6
  pour Bottom (no thermals): 124.8,13.8 123.4,13.8 123.4,13.2 124.8,13.2
VCC_MCU  (via drill 0.5)
  Top 0.25: C1.1 105.2,13.6 105.3,13.7 v105.3,14.7 105.6,15 108.5,15 108.72,14.77 IC1.15
  Bottom 0.25: v105.3,14.7 105.06,14.94 VCC_MCU.1

### Text on the board
Dimension: Bottom Board of PCB Sandwich
tPlace: M2 | 1 | 5 | 20 | 10 | 15 | www.pegasusprototyping.ca/stattracker | 21 | 25 | 30 | 35 | 40 | VBAT | 41 | GND | VCC | STATUS | VBUS5V | 45 | GND | Rev 1.2
bPlace: M2 | www.pegasusprototyping.ca/stattracker | VBAT | + | VCC | DOUT | GND | GND | - | Rev 1.1 | VBUS5V | GND
Document: HP- | HP+ | EP- | EP+ | DP- | DP+